# Altium schematic sheet Power Supply Noise Canceller.SchDoc
size A
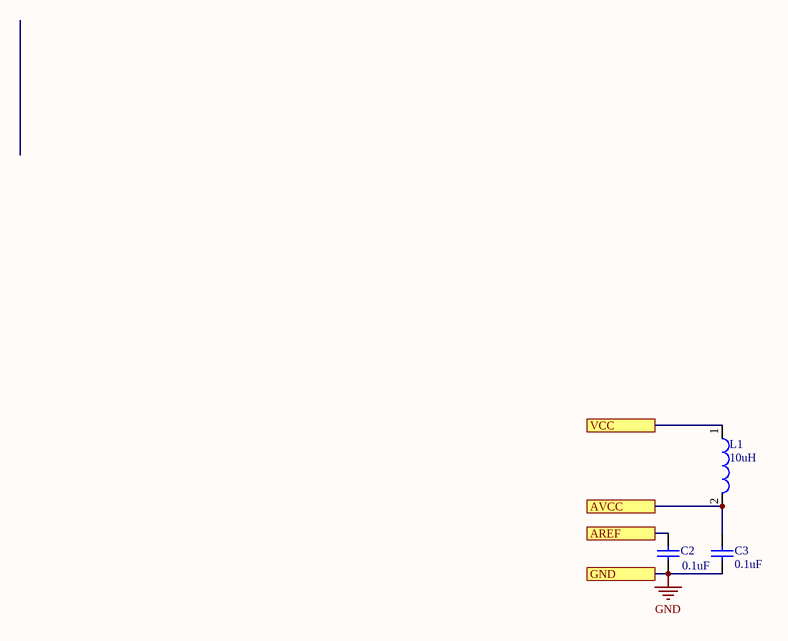
[diagram p0: Power Supply Noise Canceller.SchDoc]

## Parts
C2  0.1uF  [CAPC2013X94X50LL20T25]
C3  0.1uF  [CAPC2013X94X50LL20T25]
L1  10uH  [SMD 0805_A]

## Ports
AREF, AVCC, GND, VCC

## Nets
GND: C2.1 C3.1 ; port GND
AREF: C2.2 ; port AREF
AVCC: C3.2 L1.2 ; port AVCC
VCC: L1.1 ; port VCC

## Library data of the parts
C2 C3 = CMP-2000-05808-1: Chip Capacitor, 0.1 uF, +/- 5%, 50 V, -55 to 125 degC, 0805 (2012 Metric), RoHS, Tape and Reel; Case Width: 1.25mm; Case Length: 2.01mm; Case Height: 0.94mm; Brand: AVX; Type: StandardX7RMLCCs; Capacitance - nF: 100nF; Dissipation Factor DF: 2.5; Voltage Rating DC: 50V; Temperature Coefficient / Code: +/-15%; Capacitance - pF: 100000pF; Dielectric: X7R; Dimensions: 1.25mmWx2.01mmLx0.94mmH; Product: GeneralTypeMLCCs; Package Description: 2-Pin Surface Mount Device, Body 2.01 x 1.25 mm; Capacitance: 0.1uF; Package / Case: 0805(2012metric); Product Category: MultilayerCeramicCapacitorsMLCC-SMD/SMT; Case Code - mm: 2012; Packaging: Reel; Manufacturer URL: http://www.avx.com/; Operating Temperature Range: -55Cto+125C; Termination Style: SMD/SMT; Maximum Operating Temperature: +125C; Case Code - in: 0805; Minimum Operating Temperature: -55C; Factory Pack Quantity: 4000; RoHS: Details; Voltage Rating: 50V; Tolerance: 5%; Package Reference: 0805; Datasheet URL: http://www.farnell.com/datasheets/1679506.pdf; Manufacturer: AVX; Mounting Technology: SurfaceMount; Datasheet Version: 11/2012
L1 = CMP-1392-00038-1: Power Multilayer Inductor WE-PMI, L=10.0 µH; PartNumber: 74479777310; Manufacturer: Wuerth Elektronik; Inductance: 10.0 ÂµH; ComponentLink2URL: http://katalog.we-online.de/kataloge/eisos/media/pdf/74479777310.pdf; PackageReference: SMD 0805_A; ComponentLink2Description: Datasheet; ComponentLink1Description: Manufacturer URL; ComponentLink1URL: http://www.we-online.com